# Altium schematic sheet ICL7107_Test.SchDoc
size A3
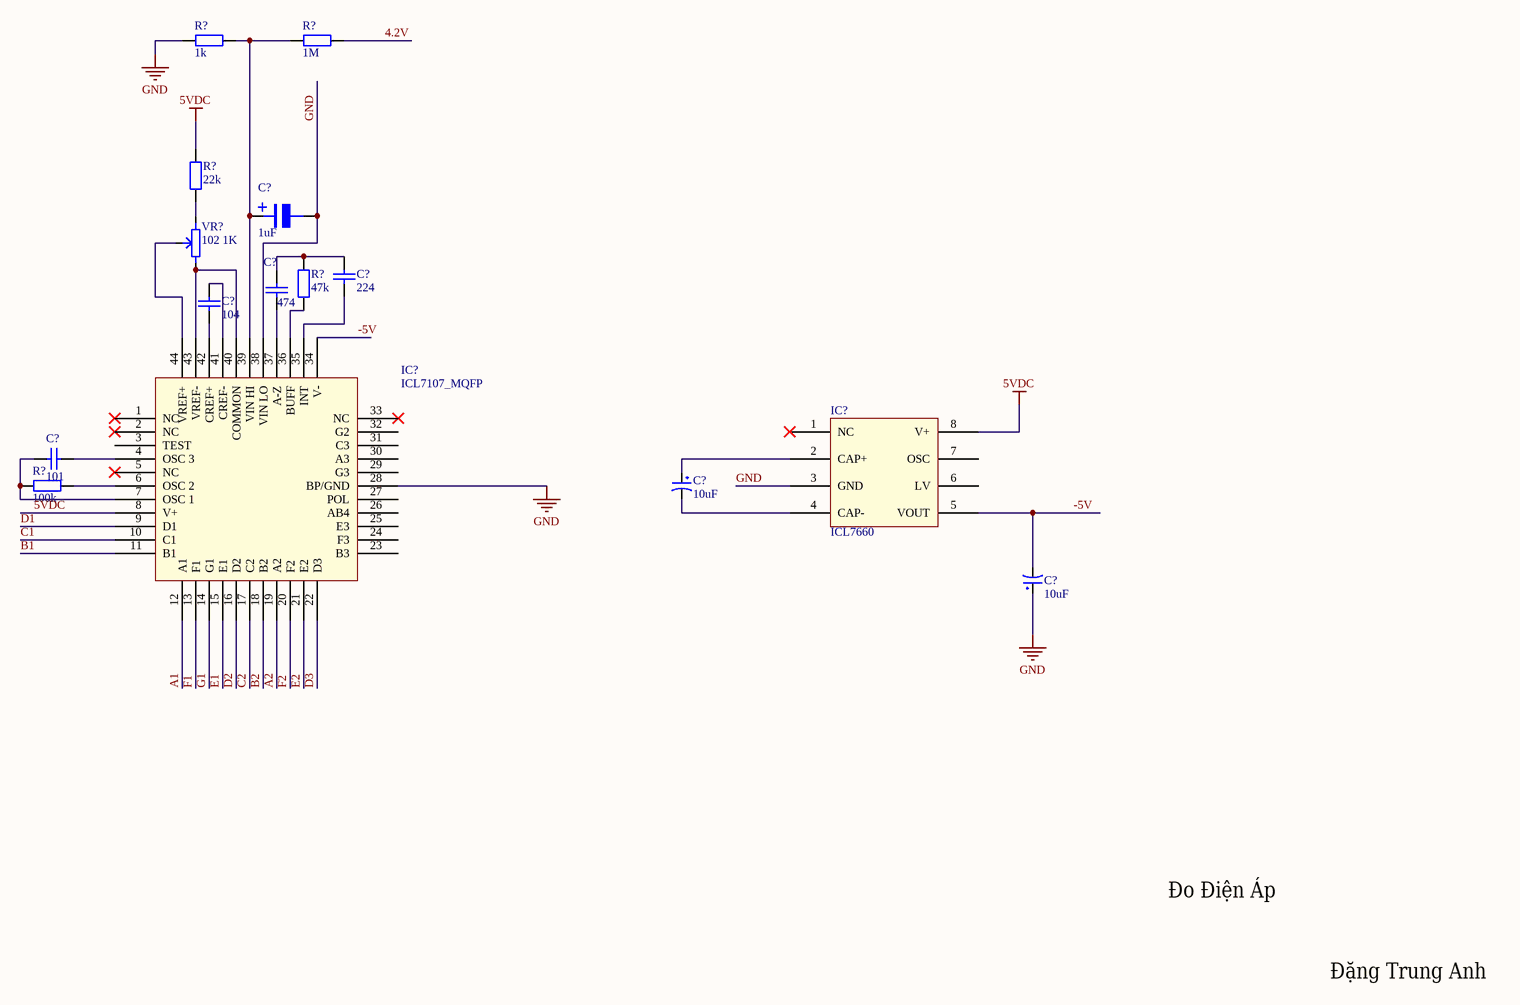
[diagram p0: ICL7107_Test.SchDoc]

## Parts
(Parts that share a designator on the sheet are numbered #1, #2 ... from top to bottom, then left to right.)
C?#1  1uF  [tu nhom 4 (B)]
C?#2  224  [tu 0805]
C?#3  474  [tu 0805]
C?#4  104  [tu 0805]
C?#5  101  [tu 0805]
C?#6  10uF  [tu hoa 4mm]
C?#7  10uF  [tu hoa 4mm]
IC?#1  ICL7660  [SOIC8_ICL7660]
IC?#2  ICL7107_MQFP  [ICL7107_MQFP44]
R?#1  1k  [tro smd 0805]
R?#2  1M  [tro smd 0805]
R?#3  22k  [tro smd 0805]
R?#4  47k  [tro smd 0805]
R?#5  100k  [tro smd 0805]
VR?  102 1K  [VR Tam Giac]

## Nets
5VDC: IC?#1.8(V+) IC?#2.8(V+) R?#3.2
GND: C?#1.2 C?#7.1 IC?#1.3(GND) IC?#2.28(BP/GND) IC?#2.38(VIN_LO) R?#1.2
4.2V: R?#2.1
-5V: C?#7.2 IC?#1.5(VOUT) IC?#2.34(V-)
A1: IC?#2.12(A1)
A2: IC?#2.19(A2)
B1: IC?#2.11(B1)
B2: IC?#2.18(B2)
C1: IC?#2.10(C1)
C2: IC?#2.17(C2)
D1: IC?#2.9(D1)
D2: IC?#2.16(D2)
D3: IC?#2.22(D3)
E1: IC?#2.15(E1)
E2: IC?#2.21(E2)
F1: IC?#2.13(F1)
F2: IC?#2.20(F2)
G1: IC?#2.14(G1)
NetC?#1_1: C?#1.1 IC?#2.39(VIN_HI) R?#1.1 R?#2.2
NetC?#2_1: C?#2.1 C?#3.1 R?#4.2
NetC?#2_2: C?#2.2 IC?#2.35(INT)
NetC?#3_2: C?#3.2 IC?#2.37(A-Z)
NetC?#4_1: C?#4.1 IC?#2.42(CREF+)
NetC?#4_2: C?#4.2 IC?#2.41(CREF-)
NetC?#5_1: C?#5.1 IC?#2.4(OSC_3)
NetC?#5_2: C?#5.2 IC?#2.7(OSC_1) R?#5.1
NetC?#6_1: C?#6.1 IC?#1.2(CAP+)
NetC?#6_2: C?#6.2 IC?#1.4(CAP-)
NetIC?#2_6: IC?#2.6(OSC_2) R?#5.2
NetIC?#2_36: IC?#2.36(BUFF) R?#4.1
NetIC?#2_40: IC?#2.40(COMMON) IC?#2.43(VREF-) VR?.1
NetIC?#2_44: IC?#2.44(VREF+) VR?.2
NetR?#3_1: R?#3.1 VR?.3

Not connected (* = marked no-connect by the designer): IC?#1 1(NC)* 6(LV) 7(OSC); IC?#2 1(NC)* 2(NC)* 3(TEST) 5(NC)* 23(B3) 24(F3) 25(E3) 26(AB4) 27(POL) 29(G3) 30(A3) 31(C3) 32(G2) 33(NC)*

## Notes on the sheet
- Đo Điện Áp
- Đặng Trung Anh
- (in symbol Tu Nhom 1uF 50V) +

## Library data of the parts
C?#1 = Tu Nhom 1uF 50V: Dán; Don_Vi: Con; So_Chan: 2; Ten_Linh_Kien: Tụ Nhôm 1uF 50V 4x5.4MM; Ma_Hang: MH007467; Chung_Loai: Dán; Kieu_Chan: *
C?#2 = Tu 0805 224 50V 10%: Dán; Don_Vi: Con; So_Chan: 2; Ten_Linh_Kien: Tụ 0805 224-0.22uF 10% 50V; Ma_Hang: MH004559; Chung_Loai: Dán; Kieu_Chan: *
C?#3 = Tu 0805 474 50V 10%: Dán; Don_Vi: Con; So_Chan: 2; Ten_Linh_Kien: Tụ 0805 474-470nF 50V 10%; Ma_Hang: MH006116; Chung_Loai: Dán; Kieu_Chan: *
C?#4 = Tu 0805 104 50V 10%: Dán; Don_Vi: Con; So_Chan: 2; Ten_Linh_Kien: Tụ 0805 104-100nF 10% 50V; Ma_Hang: MH004551; Chung_Loai: Dán; Kieu_Chan: *
C?#5 = Tu 0805 101 50V 20%: Dán; Don_Vi: Con; So_Chan: 2; Ten_Linh_Kien: Tụ 0805 101-0.1nF 50V 20%; Ma_Hang: MH002806; Chung_Loai: Dán; Kieu_Chan: *
C?#6 C?#7 = Tu Hoa 10uF 25V 4x7: Cắm; So_Chan: 2; Ten_Linh_Kien: Tụ Hóa 10uF 25V 4x7MM; Don_Vi: Con; Ma_Hang: MH001349; Chung_Loai: Cắm; Kieu_Chan: *
IC?#1 = ICL7660_SOIC8
R?#1 = Tro 0805 5% 1k: Dán; Don_Vi: Con; So_Chan: 2; Ten_Linh_Kien: Trở 0805 5% 1k; Ma_Hang: MH005234; Chung_Loai: Dán; Kieu_Chan: *
R?#2 = Tro 0805 5% 1M: Dán; Don_Vi: Con; So_Chan: 2; Ten_Linh_Kien: Trở 0805 5% 1M; Ma_Hang: MH005235; Chung_Loai: Dán; Kieu_Chan: *
R?#3 = Tro 0805 5% 22k: Dán; Don_Vi: Con; So_Chan: 2; Ten_Linh_Kien: Trở 0805 5% 22k; Ma_Hang: MH005248; Chung_Loai: Dán; Kieu_Chan: *
R?#4 = Tro 0805 5% 47k: Dán; Don_Vi: Con; So_Chan: 2; Ten_Linh_Kien: Trở 0805 5% 47k; Ma_Hang: MH005320; Chung_Loai: Dán; Kieu_Chan: *
R?#5 = Tro 0805 5% 100k: Dán; Don_Vi: Con; So_Chan: 2; Ten_Linh_Kien: Trở 0805 5% 100k; Ma_Hang: MH005250; Chung_Loai: Dán; Kieu_Chan: *
VR? = Bien tro tam giac 1K: Cắm; Ten_Linh_Kien: Biến Trở Tam Giác 102-1K RM065; Don_Vi: Con; Ma_Hang: MH003709; Ghi_Chu: *; Kieu_Chan: *; Chung_Loai: Cắm